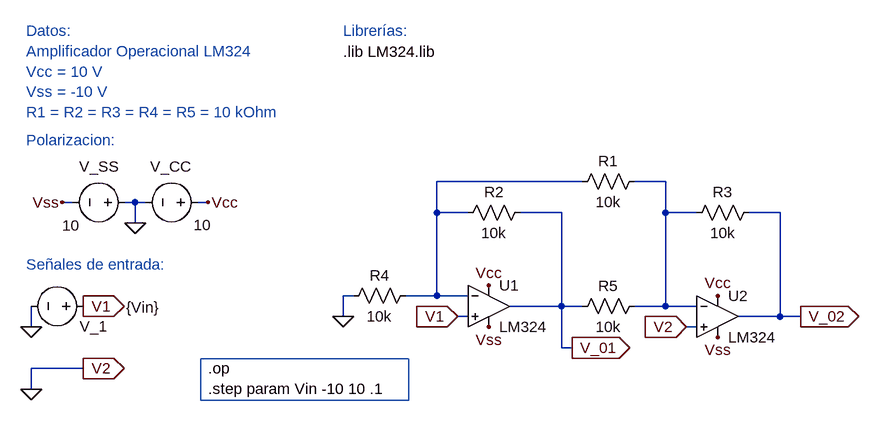
[diagram p0: schematic Lab_1_Circ_1_V1.asc]
Lab_1_Circ_1_V1.asc, the LTspice schematic file:
Version 4
SHEET 1 1560 680
WIRE 256 -144 32 -144
WIRE 384 -144 336 -144
WIRE -528 -112 -544 -112
WIRE -432 -112 -448 -112
WIRE -416 -112 -432 -112
WIRE -320 -112 -336 -112
WIRE 32 -96 32 -144
WIRE 80 -96 32 -96
WIRE 224 -96 160 -96
WIRE 384 -96 384 -144
WIRE 432 -96 384 -96
WIRE 560 -96 512 -96
WIRE -432 -80 -432 -112
WIRE -96 32 -112 32
WIRE 32 32 32 -96
WIRE 32 32 -16 32
WIRE 80 32 32 32
WIRE 224 48 224 -96
WIRE 224 48 144 48
WIRE 256 48 224 48
WIRE 384 48 384 -96
WIRE 384 48 336 48
WIRE 432 48 384 48
WIRE -112 64 -112 32
WIRE 80 64 64 64
WIRE 560 64 560 -96
WIRE 560 64 496 64
WIRE 592 64 560 64
WIRE -592 80 -592 48
WIRE 432 80 416 80
WIRE 224 112 224 48
WIRE 240 112 224 112
WIRE -512 144 -592 144
WIRE -592 176 -592 144
FLAG -112 64 0
FLAG -320 -112 Vcc
FLAG 112 16 Vcc
FLAG 464 32 Vcc
FLAG -544 -112 Vss
FLAG 112 80 Vss
FLAG 464 96 Vss
FLAG -432 -80 0
FLAG -592 80 0
FLAG -592 176 0
FLAG 240 112 V_01
IOPIN 240 112 Out
FLAG 592 64 V_02
IOPIN 592 64 Out
FLAG 64 64 V1
IOPIN 64 64 In
FLAG 416 80 V2
IOPIN 416 80 In
FLAG -512 48 V1
IOPIN -512 48 Out
FLAG -512 144 V2
IOPIN -512 144 Out
SYMBOL OpAmps\\opamp2 112 -16 R0
SYMATTR InstName U1
SYMATTR Value LM324
SYMBOL OpAmps\\opamp2 464 0 R0
SYMATTR InstName U2
SYMATTR Value LM324
SYMBOL res 352 -160 R90
WINDOW 0 0 56 VBottom 2
WINDOW 3 32 56 VTop 2
SYMATTR InstName R1
SYMATTR Value 10k
SYMBOL res 176 -112 R90
WINDOW 0 0 56 VBottom 2
WINDOW 3 32 56 VTop 2
SYMATTR InstName R2
SYMATTR Value 10k
SYMBOL res 528 -112 R90
WINDOW 0 0 56 VBottom 2
WINDOW 3 32 56 VTop 2
SYMATTR InstName R3
SYMATTR Value 10k
SYMBOL res 0 16 R90
WINDOW 0 0 56 VBottom 2
WINDOW 3 32 56 VTop 2
SYMATTR InstName R4
SYMATTR Value 10k
SYMBOL res 352 32 R90
WINDOW 0 0 56 VBottom 2
WINDOW 3 32 56 VTop 2
SYMATTR InstName R5
SYMATTR Value 10k
SYMBOL voltage -496 48 M270
WINDOW 0 -31 21 VLeft 2
WINDOW 3 -2 -50 VLeft 2
WINDOW 123 0 0 Left 0
WINDOW 39 0 0 Left 0
SYMATTR InstName V_1
SYMATTR Value {Vin}
SYMBOL voltage -320 -112 R90
WINDOW 0 -55 25 VRight 2
WINDOW 3 35 -5 VRight 2
WINDOW 123 0 0 Left 0
WINDOW 39 0 0 Left 0
SYMATTR InstName V_CC
SYMATTR Value 10
SYMBOL voltage -432 -112 R90
WINDOW 0 -55 25 VRight 2
WINDOW 3 36 85 VRight 2
WINDOW 123 0 0 Left 0
WINDOW 39 0 0 Left 0
SYMATTR InstName V_SS
SYMATTR Value 10
TEXT -112 -344 Left 2 !.lib LM324.lib
TEXT -112 -376 Left 2 ;Librerías:
TEXT -600 -208 Left 2 ;Polarizacion:
TEXT -600 -16 Left 2 ;Señales de entrada:
TEXT -600 -376 Left 2 ;Datos:\nAmplificador Operacional LM324\nVcc = 10 V\nVss = -10 V\nR1 = R2 = R3 = R4 = R5 = 10 kOhm
TEXT -320 144 Left 2 !.op\n.step param Vin -10 10 .1
RECTANGLE Normal -11 193 -331 129

The netlist it stands for:
* Lab_1_Circ_1_V1.asc
XU1 V1 N001 Vcc Vss V_01 LM324  ; pins In+ In- V+ V- OUT
XU2 0 N002 Vcc Vss V_02 LM324  ; pins In+ In- V+ V- OUT
R1 N002 N001 10k
R2 V_01 N001 10k
R3 V_02 N002 10k
R4 N001 0 10k
R5 N002 V_01 10k
V_1 V1 0 {Vin}
V_CC Vcc 0 10
V_SS 0 Vss 10
.lib LM324.lib
* Librerías:
* Polarizacion:
* Señales de entrada:
* Datos:
* Amplificador Operacional LM324
* Vcc = 10 V
* Vss = -10 V
* R1 = R2 = R3 = R4 = R5 = 10 kOhm
.op
.step param Vin -10 10 .1
.backanno
.end